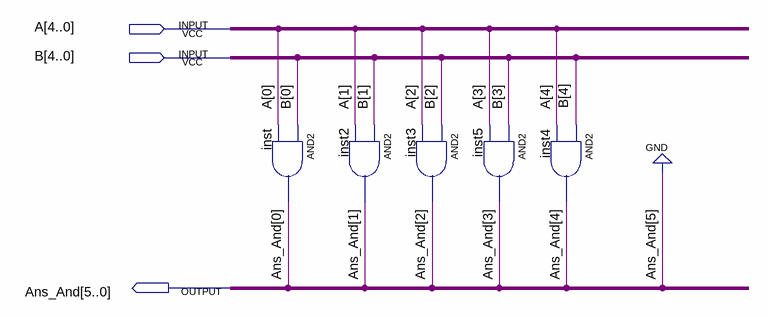
[diagram p0: schematic sheet]
// Quartus schematic and_bitbit.bdf as structural Verilog: 5 symbols, 3 pins
module and_bitbit (
  input  [4:0] A,
  input  [4:0] B,
  output [5:0] Ans_And
);

  and inst (Ans_And[0], B[0], A[0]);
  and inst2 (Ans_And[1], B[1], A[1]);
  and inst3 (Ans_And[2], B[2], A[2]);
  and inst4 (Ans_And[4], B[4], A[4]);
  and inst5 (Ans_And[3], B[3], A[3]);

  assign Ans_And[5] = 1'b0;
endmodule
